# EAGLE design Sensor-line (EAGLE 6.5.0)
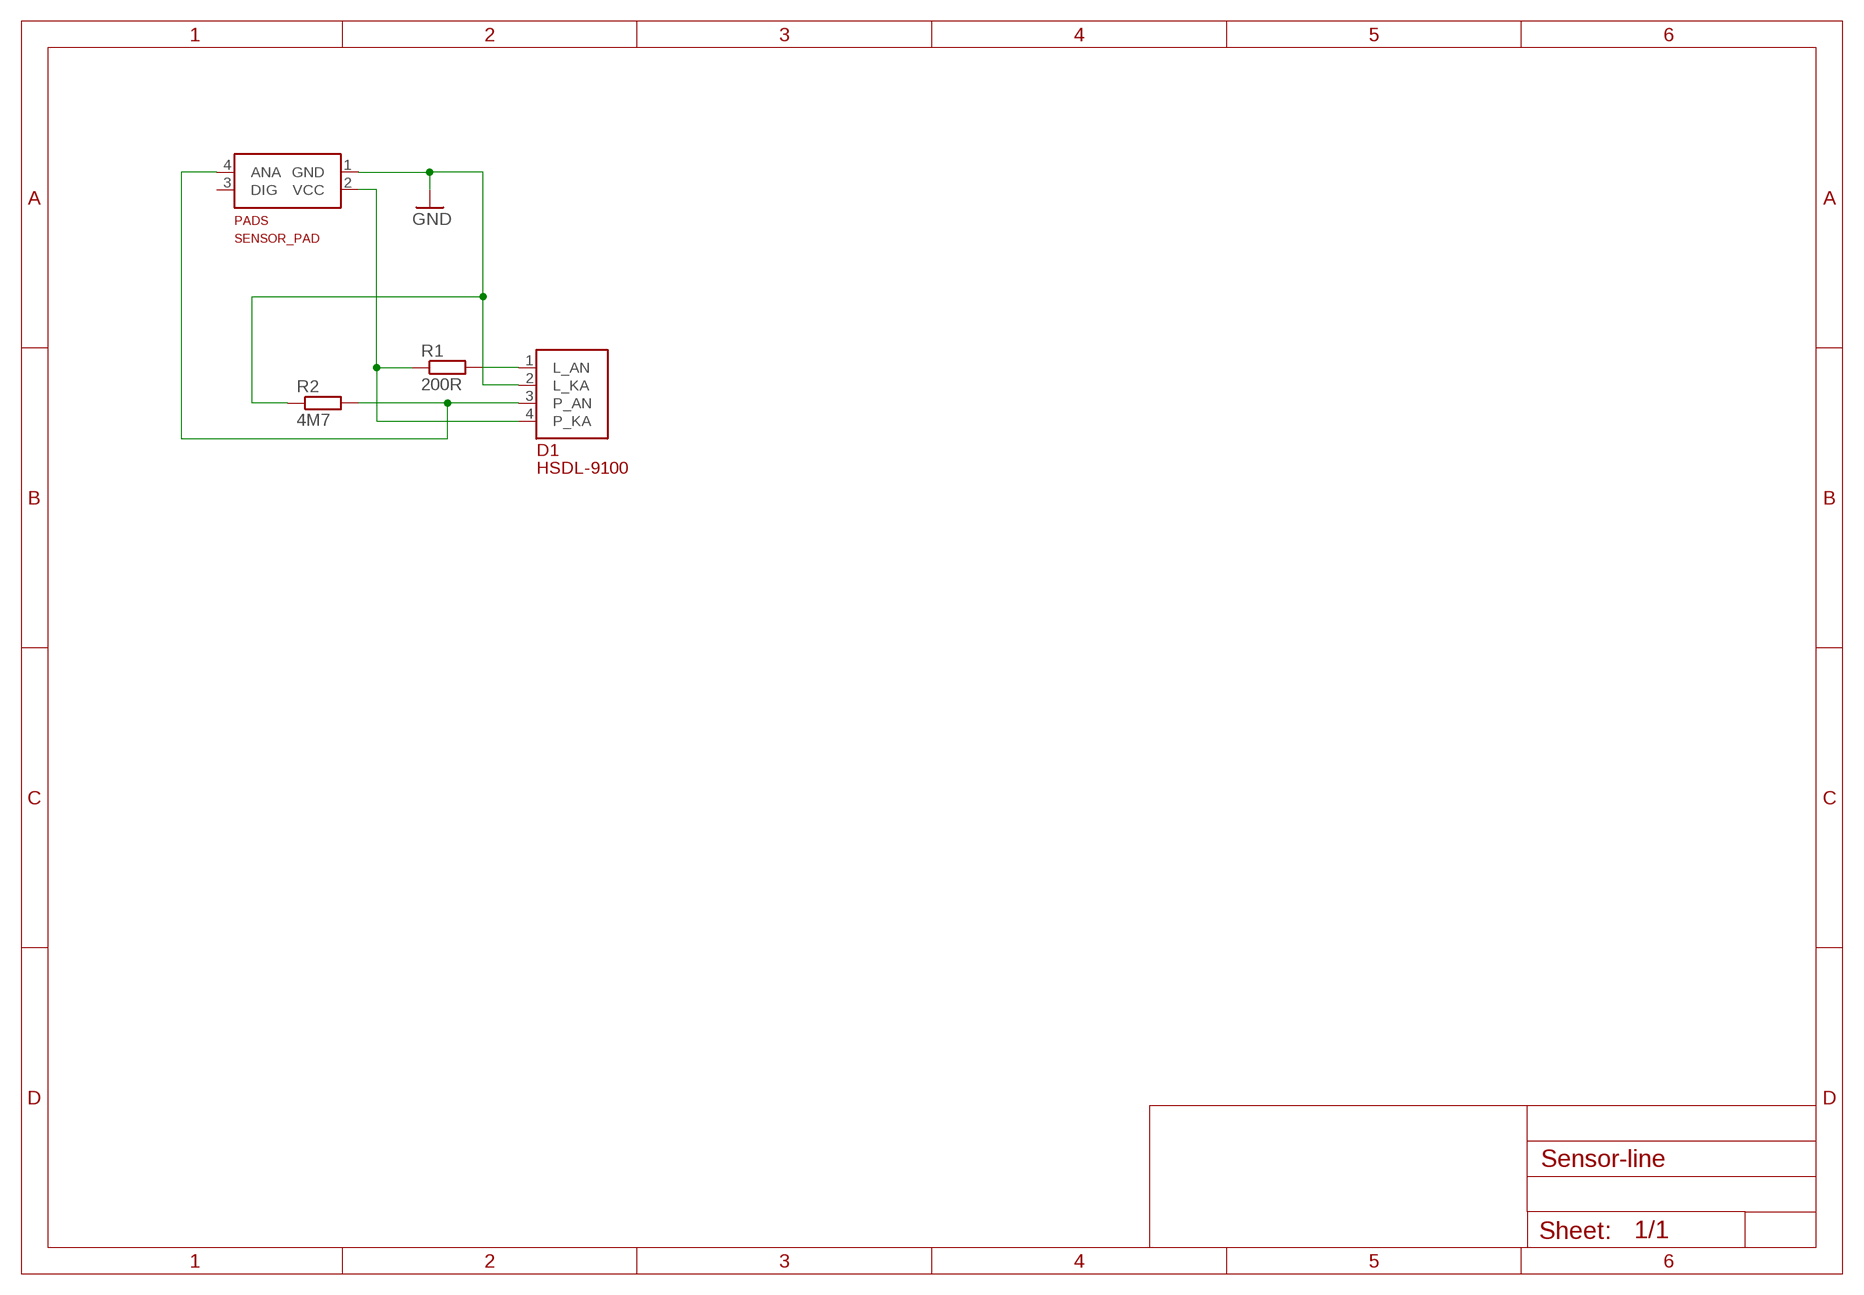
[diagram p0: schematic, sheet 1]

## Parts
D1  HSDL-9100  [HSDL-9100]
PADS  SENSOR_PAD  [SENSOR_PAD]
R1  200R  R-EU_R1206  [R1206]
R2  4M7  R-EU_R0805  [R0805]

## Nets
GND: D1.2(L_KA) PADS.1(GND) R2.1
N$2: D1.1(L_AN) R1.2
N$3: D1.3(P_AN) PADS.4(ANA) R2.2
N$4: D1.4(P_KA) PADS.2(VCC) R1.1
Unconnected: PADS.3(DIG)

## Library data of the parts
D1 = sduino:HSDL-9100; MF: AVAGO TECHNOLOGIES; MPN: HSDL-9100-021; OC_FARNELL: 9613846
PADS = sduino:SENSOR_PAD; OC_FARNELL: unknown
R1 = resistor:R-EU_: RESISTOR, European symbol; MF: PANASONIC ELECTRONIC COMPONENTS; MPN: ERJ8ENF2000V; OC_FARNELL: 2057752
R2 = resistor:R-EU_: RESISTOR, European symbol; MF: WELWYN; MPN: ASC0805-4M7FT5; OC_FARNELL: 2078979

## Board
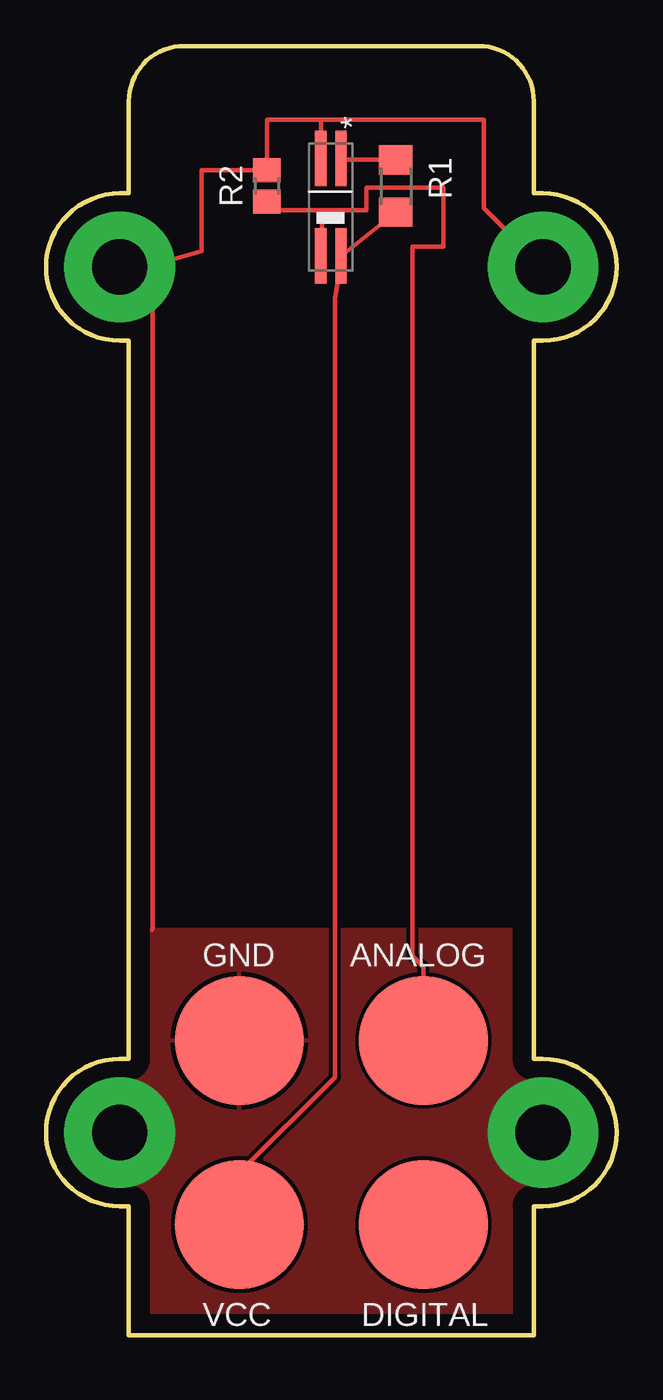
[diagram p1: board, top side]

Size 31 x 70 mm. Coordinates in mm from the lower left corner, seen from the top.
Outline: 26.5,0 4.5,0 4.5,7 4,7 arc-180 4,15 4.5,15 4.5,54 4,54 arc-180 4,62 4.5,62 4.5,67 arc-90 7.5,70 23.5,70 arc-90 26.5,67 26.5,62 27,62 arc-180 27,54 26.5,54 26.5,15 27,15 arc-180 27,7 26.5,7 26.5,0
Copper layers (1*16): Top 0.035mm / dielectric 1.5mm / Bottom 0.035mm
Design rules "default": minimum track width 10mil, minimum drill 24mil, track to track 8mil, track to pad 8mil, pad to pad 8mil, via to via 8mil, smd to smd 8mil, copper to edge 40mil, drill to drill 8mil, minimum pad ring 10mil, minimum via ring 8mil, stop-mask expansion 4mil, vias tented up to drill 0mil, thermal gap 10mil

### Footprints (pad centres in the part's own frame; a part is rotated, then mirrored left to right if it is on the bottom)
HSDL-9100 = smd 3 x 0.6: 1 0.8,1.725; 2 0.8,0.625; 3 6.1,0.625; 4 6.1,1.725
SENSOR_PAD = smd 7 x 7 bottom: 1 16,16; 2 16,6; 3 6,6; 4 6,16
R1206 = smd 1.6 x 1.803: 1 -1.422,0; 2 1.422,0
R0805 = smd 1.3 x 1.5: 1 -0.85,0; 2 0.85,0

### Placement (x,y rotation side)
D1  14.3,64.7 270 top
PADS  26.5,0 0 bottom
R1  19,62.4 90 top
R2  12,62.4 270 top

### Tracks (layer width: path | path; a pad name or v marks a point on that pad's centre or on a via)
GND  (via drill 3 pad 6)
  Top 0.254: 5.3,58 5.4,58 8.45,58.85 8.45,63.25 R2.1 12,66 14.93,66 | v27,58 23.8,61.2 23.8,66 14.93,66 | 15.1,63.6 D1.2 14.93,66 | 5.3,58 5.8,57.5 5.8,22.1 5.77,22 | 5.3,58 v4,58
  other vias: 4,11 27,11
  pour Top: -1.5,22 -1.5,-2 33.5,-2 33.5,22
N$2
  Top 0.254: 16.2,63.82 16.2,64.4 | D1.1 16.2,63.7 16.2,63.82 | 16.2,63.82 R1.2
N$3
  Top 0.254: 15,61.1 15,58.8 D1.3 | PADS.4 20.5,20 19.9,20.6 19.9,59.1 21.6,59.1 21.6,62.3 17.4,62.3 17.4,61.1 15,61.1 | 15,61.1 11.4,61.1 R2.2
N$4
  Top 0.254: PADS.2 10.5,8.8 15.7,14 15.7,56.3 16.1,58.7 D1.4 R1.1